# EAGLE schematic EEPROM DIP Breakout WP Pin Board (EAGLE 8.4.0)
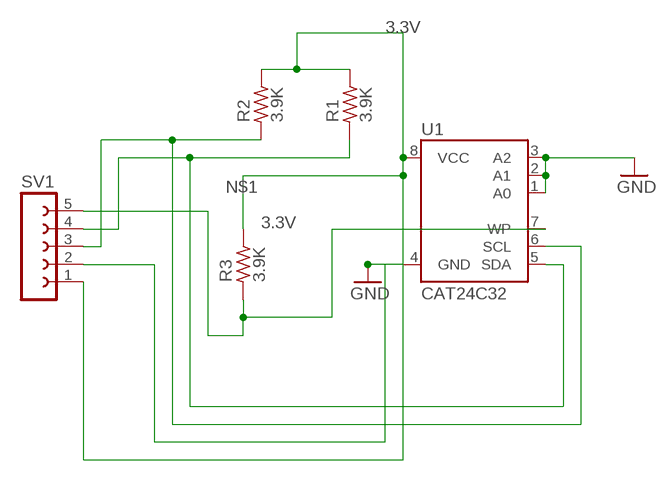
[diagram p0: schematic, sheet 1]

## Parts
R1  3.9K  R_X0204/7  [0204/7]
R2  3.9K  R_X0204/7  [0204/7]
R3  3.9K  R_X0204/7  [0204/7]
SV1  FE05-1  [FE05-1]
U1  CAT24C32  AT24CP  [DIL08]

## Nets
3.3V: R1.2 R2.2 R3.2 SV1.1 U1.8(VCC)
GND: SV1.2 U1.1(A0) U1.2(A1) U1.3(A2) U1.4(GND)
N$1: R1.1 SV1.4 U1.5(SDA)
N$2: R2.1 SV1.3 U1.6(SCL)
N$16: R3.1 SV1.5 U1.7(WP)

## Library data of the parts
R1-R3 = rc-master:R_: RESISTOR
SV1 = con-lsta:FE05-1: FEMALE HEADER; OC_FARNELL: unknown; OC_NEWARK: unknown
U1 = atmel:AT24C*: 2-wire serial EEPROM; MPN: AT24C1024BW-SH-B; OC_FARNELL: 1362646; OC_NEWARK: 03P2044